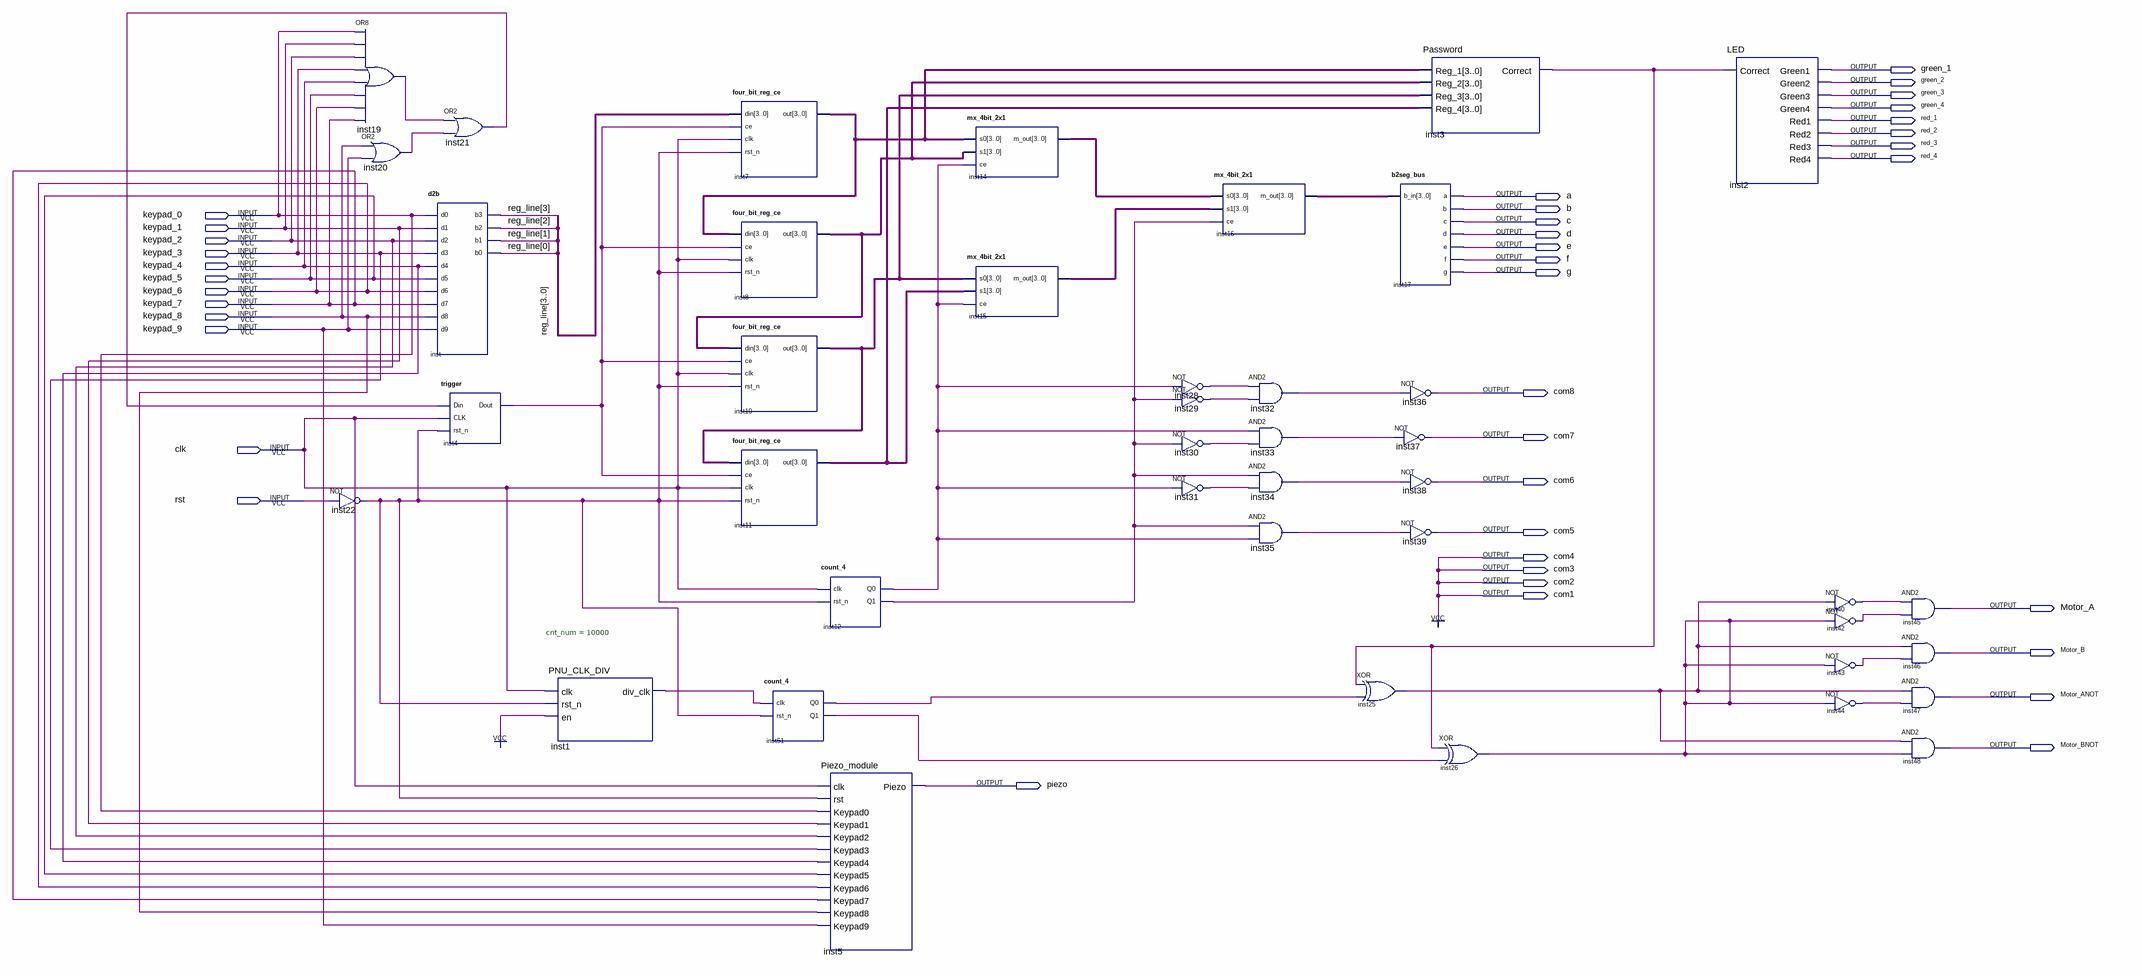
[diagram p0: schematic sheet]
// Quartus schematic week11.bdf as structural Verilog: 42 symbols, 40 pins
module week11 (
  input  keypad_0,
  input  keypad_1,
  input  keypad_2,
  input  keypad_3,
  input  keypad_4,
  input  keypad_5,
  input  keypad_6,
  input  keypad_7,
  input  keypad_8,
  input  keypad_9,
  input  clk,
  input  rst,
  output green_1,
  output green_2,
  output green_3,
  output green_4,
  output red_1,
  output red_2,
  output red_3,
  output red_4,
  output a,
  output b,
  output c,
  output d,
  output e,
  output f,
  output g,
  output com8,
  output com7,
  output com6,
  output com5,
  output com4,
  output com3,
  output com2,
  output com1,
  output Motor_A,
  output Motor_B,
  output Motor_ANOT,
  output Motor_BNOT,
  output piezo
);

  wire inst1_div_clk, inst3_correct, inst4_dout, inst12_q0, inst12_q1, inst19_out, inst20_out, inst21_out,
       inst22_out, inst25_out, inst26_out, inst28_out, inst29_out, inst30_out, inst31_out, inst32_out,
       inst33_out, inst34_out, inst35_out, inst40_out, inst42_out, inst43_out, inst44_out, inst51_q0,
       inst51_q1;
  wire [3:0] inst7_out, inst8_out, inst10_out, inst11_out, inst14_m_out, inst15_m_out, inst16_m_out, reg_line;

  or inst19 (inst19_out, keypad_0, keypad_1, keypad_2, keypad_3, keypad_4, keypad_5, keypad_6, keypad_7);
  not inst22 (inst22_out, rst);
  or inst20 (inst20_out, keypad_8, keypad_9);
  or inst21 (inst21_out, inst19_out, inst20_out);
  d2b inst (
    .d0(keypad_0), .d1(keypad_1), .d2(keypad_2), .d3(keypad_3), .d4(keypad_4), .d5(keypad_5), .d6(keypad_6),
    .d7(keypad_7), .d8(keypad_8), .d9(keypad_9), .b3(reg_line[3]), .b2(reg_line[2]), .b1(reg_line[1]),
    .b0(reg_line[0]));
  trigger inst4 (.Din(inst21_out), .CLK(clk), .rst_n(inst22_out), .Dout(inst4_dout));
  PNU_CLK_DIV #(.cnt_num(10000)) inst1 (.clk(clk), .rst_n(inst22_out), .en(1'b1), .div_clk(inst1_div_clk));
  four_bit_reg_ce inst7 (.din(reg_line), .ce(inst4_dout), .clk(clk), .rst_n(inst22_out), .out(inst7_out));
  four_bit_reg_ce inst8 (.din(inst7_out), .ce(inst4_dout), .clk(clk), .rst_n(inst22_out), .out(inst8_out));
  four_bit_reg_ce inst10 (.din(inst8_out), .ce(inst4_dout), .clk(clk), .rst_n(inst22_out), .out(inst10_out));
  four_bit_reg_ce inst11 (.din(inst10_out), .ce(inst4_dout), .clk(clk), .rst_n(inst22_out), .out(inst11_out));
  count_4 inst51 (.clk(inst1_div_clk), .rst_n(inst22_out), .Q0(inst51_q0), .Q1(inst51_q1));
  count_4 inst12 (.clk(clk), .rst_n(inst22_out), .Q0(inst12_q0), .Q1(inst12_q1));
  Piezo_module inst5 (
    .clk(clk), .rst(inst22_out), .Keypad0(keypad_0), .Keypad1(keypad_1), .Keypad2(keypad_2),
    .Keypad3(keypad_3), .Keypad4(keypad_4), .Keypad5(keypad_5), .Keypad6(keypad_6), .Keypad7(keypad_7),
    .Keypad8(keypad_8), .Keypad9(keypad_9), .Piezo(piezo));
  mx_4bit_2x1 inst14 (.s0(inst7_out), .s1(inst8_out), .ce(inst12_q0), .m_out(inst14_m_out));
  mx_4bit_2x1 inst15 (.s0(inst10_out), .s1(inst11_out), .ce(inst12_q0), .m_out(inst15_m_out));
  mx_4bit_2x1 inst16 (.s0(inst14_m_out), .s1(inst15_m_out), .ce(inst12_q1), .m_out(inst16_m_out));
  not inst28 (inst28_out, inst12_q0);
  not inst29 (inst29_out, inst12_q1);
  not inst30 (inst30_out, inst12_q1);
  not inst31 (inst31_out, inst12_q0);
  and inst32 (inst32_out, inst28_out, inst29_out);
  and inst33 (inst33_out, inst12_q0, inst30_out);
  and inst34 (inst34_out, inst12_q1, inst31_out);
  and inst35 (inst35_out, inst12_q1, inst12_q0);
  xor inst25 (inst25_out, inst3_correct, inst51_q0);
  Password inst3 (
    .Reg_1(inst7_out), .Reg_2(inst8_out), .Reg_3(inst10_out), .Reg_4(inst11_out), .Correct(inst3_correct));
  b2seg_bus inst17 (.b_in(inst16_m_out), .a(a), .b(b), .c(c), .d(d), .e(e), .f(f), .g(g));
  not inst36 (com8, inst32_out);
  not inst37 (com7, inst33_out);
  not inst38 (com6, inst34_out);
  not inst39 (com5, inst35_out);
  xor inst26 (inst26_out, inst3_correct, inst51_q1);
  LED inst2 (
    .Correct(inst3_correct), .Green1(green_1), .Green2(green_2), .Green3(green_3), .Green4(green_4),
    .Red1(red_1), .Red2(red_2), .Red3(red_3), .Red4(red_4));
  not inst40 (inst40_out, inst25_out);
  not inst42 (inst42_out, inst26_out);
  not inst43 (inst43_out, inst26_out);
  not inst44 (inst44_out, inst26_out);
  and inst45 (Motor_A, inst40_out, inst42_out);
  and inst46 (Motor_B, inst25_out, inst43_out);
  and inst47 (Motor_ANOT, inst25_out, inst44_out);
  and inst48 (Motor_BNOT, inst25_out, inst26_out);

  assign com1 = 1'b1;
  assign com2 = 1'b1;
  assign com3 = 1'b1;
  assign com4 = 1'b1;
endmodule
